# EAGLE design proto4-right (EAGLE 9.7.0)
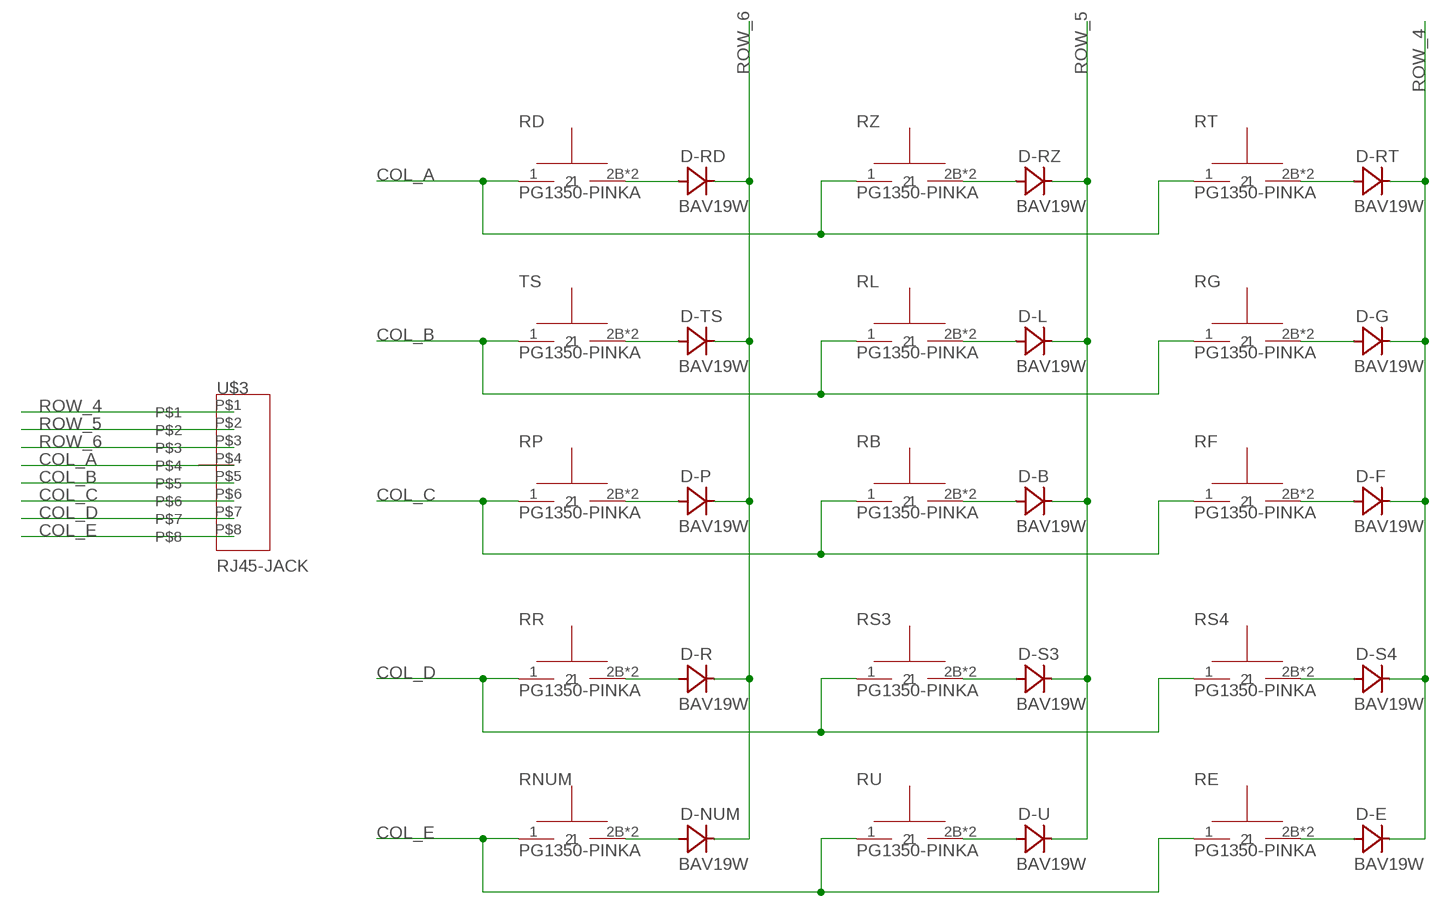
[diagram p0: schematic, sheet 1]

## Parts
D-B  BAV19W  [SOD123]
D-E  BAV19W  [SOD123]
D-F  BAV19W  [SOD123]
D-G  BAV19W  [SOD123]
D-L  BAV19W  [SOD123]
D-NUM  BAV19W  [SOD123]
D-P  BAV19W  [SOD123]
D-R  BAV19W  [SOD123]
D-RD  BAV19W  [SOD123]
D-RT  BAV19W  [SOD123]
D-RZ  BAV19W  [SOD123]
D-S3  BAV19W  [SOD123]
D-S4  BAV19W  [SOD123]
D-TS  BAV19W  [SOD123]
D-U  BAV19W  [SOD123]
RB  PG1350-PINKA  [PG1350]
RD  PG1350-PINKA  [PG1350]
RE  PG1350-PINKA  [PG1350]
RF  PG1350-PINKA  [PG1350]
RG  PG1350-PINKA  [PG1350]
RL  PG1350-PINKA  [PG1350]
RNUM  PG1350-PINKA  [PG1350]
RP  PG1350-PINKA  [PG1350]
RR  PG1350-PINKA  [PG1350]
RS3  PG1350-PINKA  [PG1350]
RS4  PG1350-PINKA  [PG1350]
RT  PG1350-PINKA  [PG1350]
RU  PG1350-PINKA  [PG1350]
RZ  PG1350-PINKA  [PG1350]
TS  PG1350-PINKA  [PG1350]
U$3  RJ45-JACK  [C-BMJ-0051-RJ45]

## Nets
COL_A: RD.1 RT.1 RZ.1 U$3.P$4
COL_B: RG.1 RL.1 TS.1 U$3.P$5
COL_C: RB.1 RF.1 RP.1 U$3.P$6
COL_D: RR.1 RS3.1 RS4.1 U$3.P$7
COL_E: RE.1 RNUM.1 RU.1 U$3.P$8
N$1: D-RD.A RD.2B RD.2T
N$2: D-RZ.A RZ.2B RZ.2T
N$3: D-RT.A RT.2B RT.2T
N$4: D-TS.A TS.2B TS.2T
N$5: D-L.A RL.2B RL.2T
N$6: D-G.A RG.2B RG.2T
N$7: D-P.A RP.2B RP.2T
N$8: D-B.A RB.2B RB.2T
N$9: D-F.A RF.2B RF.2T
N$10: D-R.A RR.2B RR.2T
N$11: D-S3.A RS3.2B RS3.2T
N$12: D-S4.A RS4.2B RS4.2T
N$13: D-NUM.A RNUM.2B RNUM.2T
N$14: D-U.A RU.2B RU.2T
N$15: D-E.A RE.2B RE.2T
ROW_4: D-E.C D-F.C D-G.C D-RT.C D-S4.C U$3.P$1
ROW_5: D-B.C D-L.C D-RZ.C D-S3.C D-U.C U$3.P$2
ROW_6: D-NUM.C D-P.C D-R.C D-RD.C D-TS.C U$3.P$3

## Library data of the parts
D-B D-E D-F D-G D-L D-NUM D-P D-R D-RD D-RT D-RZ D-S3 D-S4 D-TS D-U = Keyboard Parts:BAV19W
RB RD RE RF RG RL RNUM RP RR RS3 RS4 RT RU RZ TS = Keyboard Parts:PG1350-PINK
U$3 = Keyboard Parts:RJ45-JACK

## Board
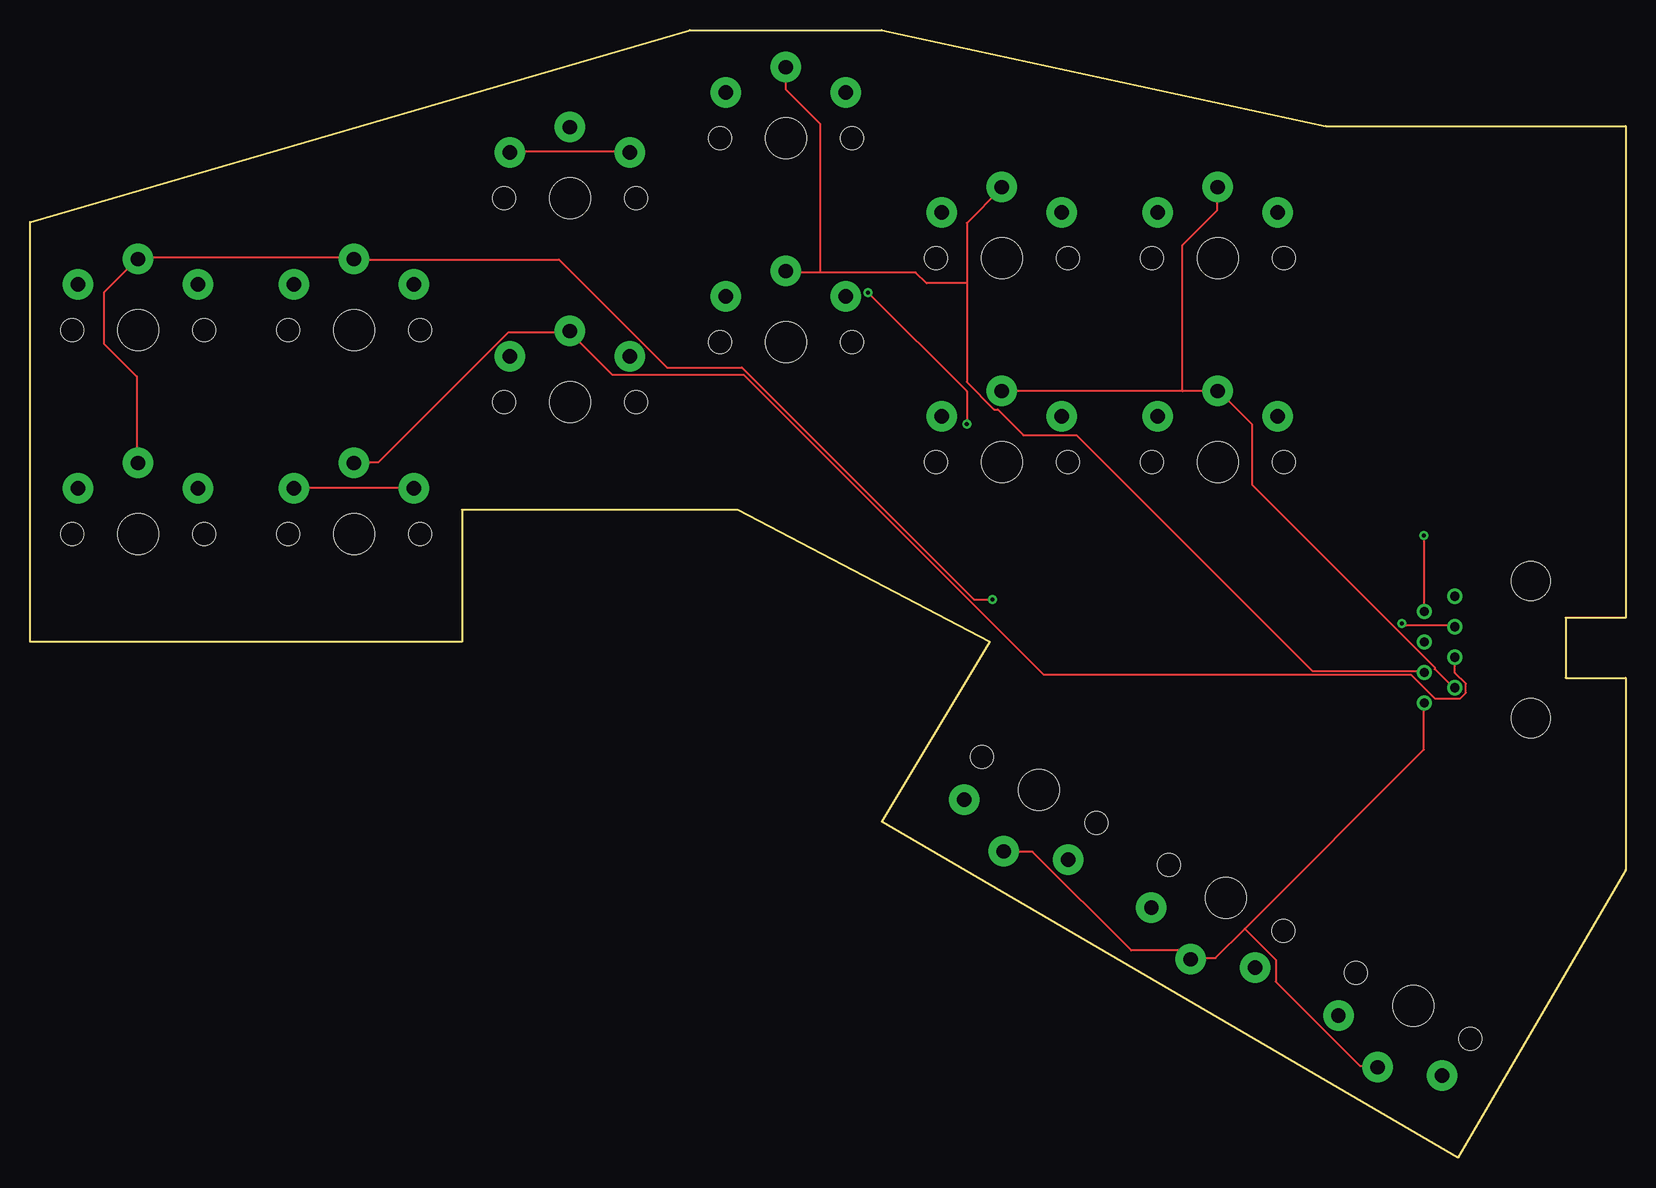
[diagram p1: board, top side]
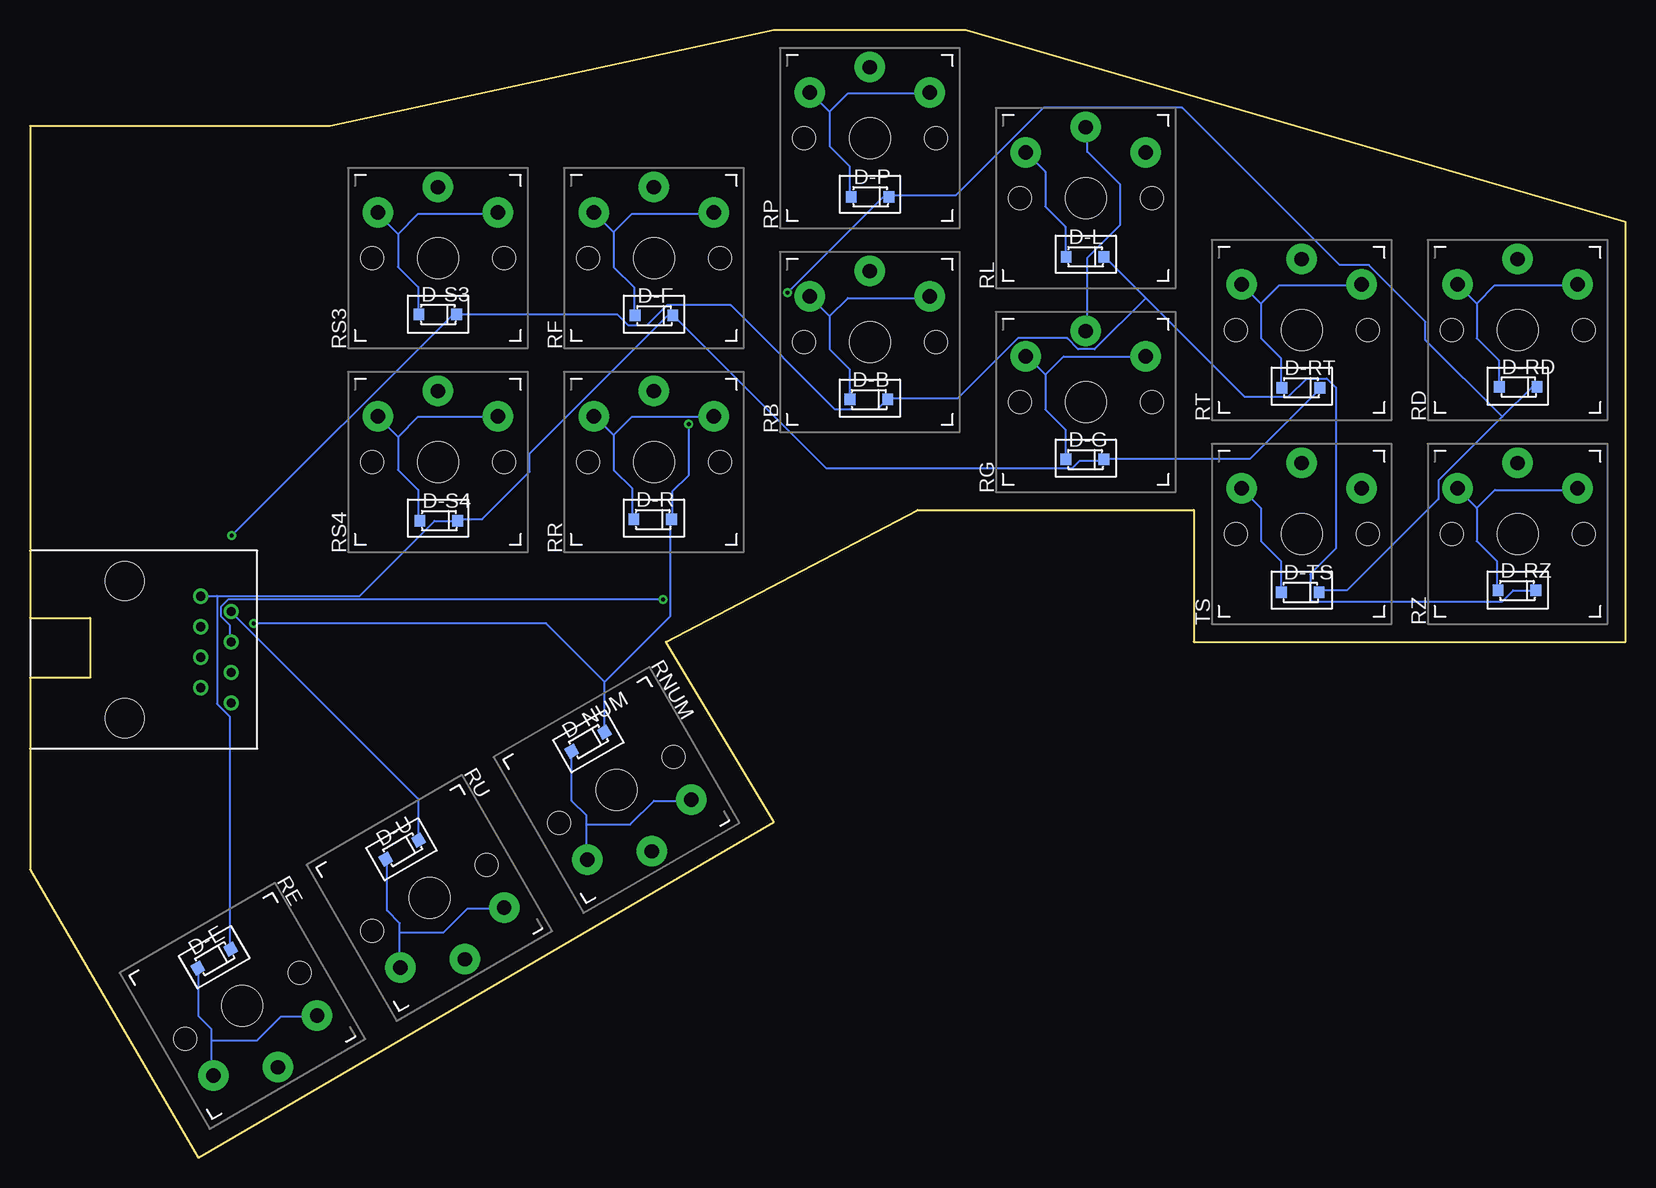
[diagram p2: board, bottom side, seen from below]

Size 133 x 94 mm. Coordinates in mm from the lower left corner, seen from the top.
Outline: 0,78 55,94 71,94 108,86 133,86 133,45 128,45 128,40 133,40 133,24 119,0 71,28 80,43 59,54 36,54 36,43 0,43 0,78
Copper layers (1*16): Top 0.035mm / dielectric 1.5mm / Bottom 0.035mm
Design rules "Fusion Electronics Design Rules": minimum track width 6mil, minimum drill 0.35mm, track to track 6mil, track to pad 6mil, pad to pad 6mil, via to via 6mil, smd to smd 6mil, copper to edge 40mil, drill to drill 6mil, minimum pad ring 10mil, minimum via ring 8mil, stop-mask expansion 4mil, vias tented up to drill 0mil, thermal gap 10mil

### Footprints (pad centres in the part's own frame; a part is rotated, then mirrored left to right if it is on the bottom)
SOD123 = smd 0.9 x 0.95: A -1.575,0; C 1.575,0
PG1350 = drill 1.2 pad 2.54: 1 5.9,0; 2B 3.8,5; 2T 3.8,-5 | hole 3.4: 0,0 | hole 1.9: 0,5.5; 0,-5.5
C-BMJ-0051-RJ45 = drill 0.76: P$1 -3.81,0; P$2 -2.54,2.54; P$3 -1.27,0; P$4 0,2.54; P$5 1.27,0; P$6 2.54,2.54; P$7 3.81,0; P$8 5.08,2.54 | hole 3.25: -5.08,-6.35; 6.35,-6.35

### Placement (x,y rotation side)
D-B  63.08,63.2 0 bottom
D-E  117.64,16.58 30 bottom
D-F  80.99,70.2 0 bottom
D-G  45.06,58.2 0 bottom
D-L  45.05,75.1 0 bottom
D-NUM  86.48,34.67 30 bottom
D-P  62.97,80.1 0 bottom
D-R  81.1,53.2 0 bottom
D-RD  8.95,64.25 0 bottom
D-RT  27.06,64.18 0 bottom
D-RZ  9.05,47.28 0 bottom
D-S3  99.01,70.3 0 bottom
D-S4  98.92,53.1 0 bottom
D-TS  27.12,47.13 0 bottom
D-U  101.98,25.67 30 bottom
RB  63,68 90 bottom
RD  9,69 90 bottom
RE  115.29,12.63 300 bottom
RF  81,75 90 bottom
RG  45,63 90 bottom
RL  45,80 90 bottom
RNUM  84.12,30.63 300 bottom
RP  63,85 90 bottom
RR  81,58 90 bottom
RS3  99,75 90 bottom
RS4  99,58 90 bottom
RT  27,69 90 bottom
RU  99.71,21.63 300 bottom
RZ  9,52 90 bottom
TS  27,52 90 bottom
U$3  118.76,42.98 270 bottom

### Tracks (layer width: path | path; a pad name or v marks a point on that pad's centre or on a via)
COL_A  (via drill 0.35)
  Top 0.152: RZ.1 8.9,57.94 8.9,65.1 6.16,67.85 6.16,72.11 8.9,74.86 RD.1 9.05,75.01 26.88,75.01 RT.1 27.03,74.86 44.1,74.86 53.09,65.87 59.34,65.87 78.7,46.51 v80.22,46.51
  Bottom 0.152: v80.22,46.51 116.49,46.51 117.1,45.9 117.1,45.14 116.34,44.38 116.34,43.01 U$3.P$4
COL_B
  Top 0.152: U$3.P$5 118.78,41.64 118.78,40.42 119.69,39.5 119.69,38.74 119.24,38.28 117.1,38.28 115.12,40.26 84.49,40.26 59.49,65.26 48.52,65.26 45.02,68.76 RG.1 44.86,68.76 39.84,68.76 29.02,57.94 27.03,57.94 TS.1
  Bottom 0.152: RL.1 44.86,85.83 44.86,83.85 42.12,81.11 42.12,77.75 44.86,75.01 44.86,68.91 RG.1
COL_C
  Top 0.152: 78.09,72.88 78.09,77.91 80.98,80.8 RF.1 | 78.09,72.88 78.09,64.65 80.37,62.36 80.68,62.36 82.81,60.23 87.23,60.23 106.89,40.57 116.19,40.57 U$3.P$6 | 65.9,73.79 73.82,73.79 74.73,72.88 78.09,72.88 | 65.9,73.79 63,73.79 RB.1 | RP.1 63,89.03 65.9,86.14 65.9,73.79
COL_D
  Top 0.152: U$3.P$7 118.63,39.2 117.1,40.72 117.1,40.87 101.86,56.11 101.86,61.14 99.12,63.88 RS4.1 98.97,63.88 96.07,63.88 | 96.07,63.88 81.14,63.88 RR.1 | 96.07,63.88 96.07,76.08 98.97,78.97 98.97,80.8 RS3.1
COL_E
  Top 0.152: 101.25,19.08 98.81,16.64 96.83,16.64 RU.1 96.68,16.64 96.07,17.25 91.8,17.25 83.57,25.48 81.29,25.48 RNUM.1 | 101.25,19.08 116.19,34.02 116.19,37.83 U$3.P$8 | 101.25,19.08 103.84,16.49 103.84,14.66 110.85,7.65 112.22,7.65 RE.1
N$1
  Bottom 0.152: 12.4,71.2 12.4,68.31 10.57,66.48 10.57,64.34 D-RD.A | 12.4,71.2 13.93,72.72 RD.2B | 12.4,71.2 10.88,72.72 4.02,72.72 RD.2T
N$2
  Bottom 0.152: 12.4,54.13 12.4,51.39 10.73,49.71 10.73,47.43 D-RZ.A | 12.4,54.13 13.93,55.66 RZ.2B | 12.4,54.13 10.88,55.66 4.02,55.66 RZ.2T
N$3
  Bottom 0.152: 30.39,71.2 30.39,68.31 28.71,66.63 28.71,64.19 D-RT.A | 30.39,71.2 31.91,72.72 RT.2B | 30.39,71.2 28.86,72.72 22,72.72 RT.2T
N$4
  Top 0.152: TS.2T 31.91,55.81 TS.2B
  Bottom 0.152: D-TS.A 28.71,47.27 28.71,49.71 30.39,51.39 30.39,54.13 31.91,55.66 TS.2B
N$5
  Top 0.152: RL.2T 40.14,83.85 49.89,83.85 RL.2B
  Bottom 0.152: D-L.A 46.69,75.16 46.69,77.6 48.37,79.28 48.37,82.17 49.89,83.7 RL.2B
N$6
  Bottom 0.152: 48.37,65.26 48.37,62.36 46.69,60.69 46.69,58.25 D-G.A | 48.37,65.26 49.89,66.78 RG.2B | 48.37,65.26 46.85,66.78 40.14,66.78 RG.2T
N$7
  Bottom 0.152: 66.35,87.2 66.35,84.31 64.68,82.63 64.68,80.19 D-P.A | 66.35,87.2 67.88,88.73 RP.2B | 66.35,87.2 64.83,88.73 58.12,88.73 RP.2T
N$8
  Bottom 0.152: 66.35,70.13 66.35,67.39 64.68,65.71 64.68,63.28 D-B.A | 66.35,70.13 67.88,71.66 RB.2B | 66.35,70.13 64.83,71.66 58.12,71.66 RB.2T
N$9
  Bottom 0.152: 84.34,77.14 84.34,74.25 82.66,72.57 82.66,70.29 D-F.A | 84.34,77.14 85.86,78.67 RF.2B | 84.34,77.14 82.81,78.67 76.11,78.67 RF.2T
N$10
  Bottom 0.152: 84.34,60.23 84.34,57.33 82.81,55.81 82.81,53.22 D-R.A | 84.34,60.23 85.86,61.75 RR.2B | 84.34,60.23 82.81,61.75 76.11,61.75 RR.2T
N$11
  Bottom 0.152: 102.32,76.99 102.32,74.25 100.64,72.57 100.64,70.44 D-S3.A | 102.32,76.99 104,78.67 RS3.2B | 102.32,76.99 100.64,78.67 94.09,78.67 RS3.2T
N$12
  Bottom 0.152: 102.32,60.08 102.32,57.33 100.64,55.66 100.64,53.22 D-S4.A | 102.32,60.08 104,61.75 RS4.2B | 102.32,60.08 100.64,61.75 94.09,61.75 RS4.2T
N$13
  Bottom 0.152: 86.62,27.77 86.62,24.87 RNUM.2T | 86.62,27.77 86.62,28.53 87.84,29.75 87.84,33.86 D-NUM.A | 86.62,27.77 82.96,27.77 80.98,29.75 77.94,29.75 RNUM.2B
N$14
  Bottom 0.152: 102.17,18.77 102.17,15.88 RU.2T | 102.17,18.77 102.17,19.54 103.23,20.6 103.23,24.87 D-U.A | 102.17,18.77 98.51,18.77 96.53,20.76 93.48,20.76 RU.2B
N$15
  Bottom 0.152: 117.86,9.78 117.86,6.89 RE.2T | 117.86,9.78 117.86,10.7 118.93,11.76 118.93,15.73 D-E.A | 117.86,9.78 114.05,9.78 112.07,11.76 109.18,11.76 RE.2B
ROW_4
  Bottom 0.152: D-RT.C 25.51,64.04 31.3,58.25 43.34,58.25 D-G.C 43.49,58.09 45.47,58.09 46.08,57.48 66.66,57.48 79.31,70.13 D-F.C 79.46,70.13 79.92,70.13 91.35,58.7 91.35,57.18 95.31,53.22 97.29,53.22 D-S4.C 97.44,53.06 99.27,53.06 105.52,46.82 117.41,46.82 | 117.41,46.82 118.63,46.82 U$3.P$1 | 117.41,46.82 117.41,37.83 116.34,36.76 116.34,17.4 D-E.C
ROW_5  (via drill 0.35)
  Top 0.152: v116.19,51.85 116.19,45.6 U$3.P$2
  Bottom 0.152: D-U.C 100.64,26.55 100.64,29.9 116.19,45.45 U$3.P$2 | 39.99,71.66 43.34,75.01 D-L.C | 39.99,71.66 31.76,63.43 28.1,63.43 26.58,64.95 24.9,64.95 24.14,64.19 24.14,50.78 26.27,48.64 26.27,46.51 26.12,46.36 10.27,46.36 9.35,47.27 7.53,47.27 D-RZ.C | 39.99,71.66 44.25,67.39 45.63,67.39 46.54,68.31 50.66,68.31 55.69,63.28 61.48,63.28 D-B.C 61.63,63.12 62.39,62.36 65.9,62.36 74.58,71.05 79.92,71.05 81.59,69.37 83.12,69.37 84.03,70.29 97.29,70.29 D-S3.C 97.44,70.29 97.75,70.29 v116.19,51.85
ROW_6  (via drill 0.35)
  Top 0.152: v114.36,44.53 114.51,44.38 118.63,44.38 U$3.P$3 | v78.09,61.14 78.09,63.88 v69.86,72.11
  Bottom 0.152: 85.1,39.65 79.61,45.14 79.61,53.06 D-R.C 79.46,53.22 79.46,55.5 78.09,56.88 v78.09,61.14 | 85.1,39.65 85.1,35.54 D-NUM.C | v114.36,44.53 89.97,44.53 85.1,39.65 | 10.27,61.75 7.83,64.19 7.53,64.19 D-RD.C | 10.27,61.75 15.6,56.42 15.6,54.89 23.22,47.27 25.51,47.27 D-TS.C | 10.27,61.75 16.67,68.15 16.67,69.68 21.4,74.4 23.83,74.4 36.94,87.51 48.52,87.51 55.84,80.19 61.32,80.19 D-P.C 61.48,80.04 61.93,80.04 v69.86,72.11